# EasyEDA Pro project uven2-mk3-cc-driver-single.eprj, schematic uven2-mk3-cc-driver
Board Name: uven2-mk3-cc-driver; Create Date: 2025-05-26; Page Name: uven2-mk3-cc-driver; Project Name: uven2-mk3-cc-driver-single; Schematic Name: uven2-mk3-cc-driver; Update Date: 2025-05-27; File: uven2-mk3-cc-driver; Id: /; Sheet: /
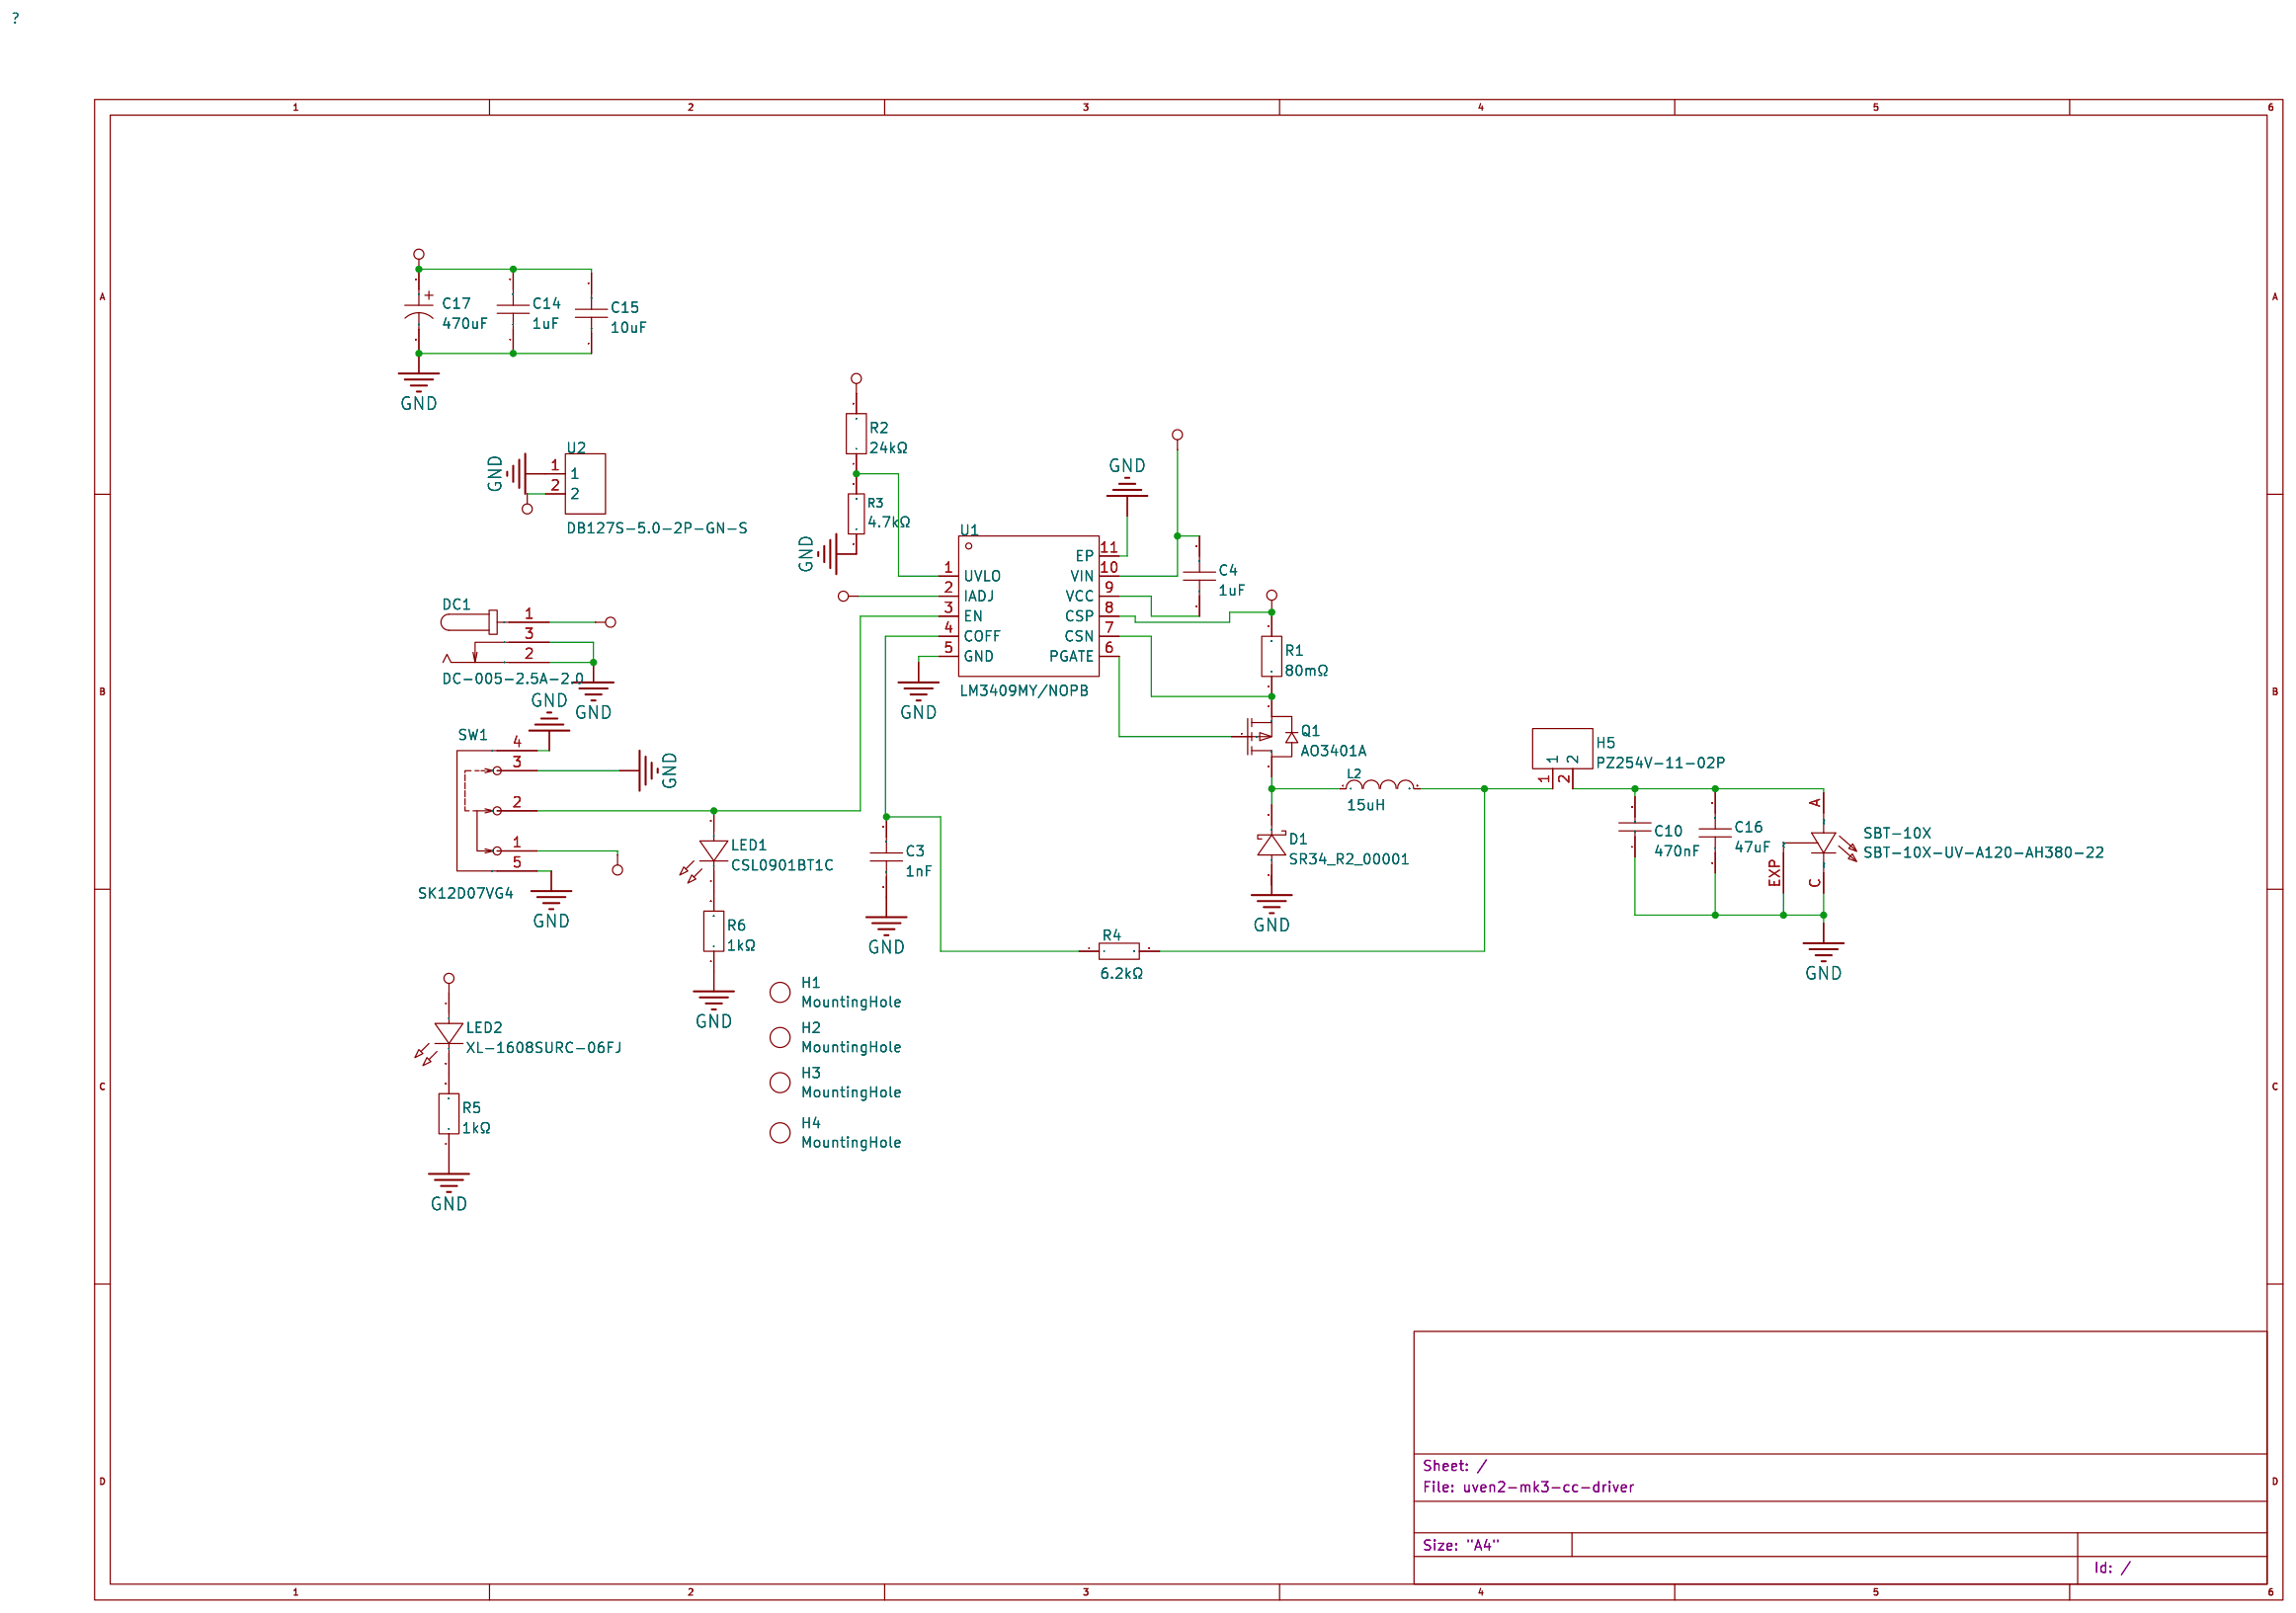
[diagram p0: schematic sheet]

## Parts
C3  1nF  [C0402]
C4  1uF  [C0603]
C10  470nF  [C0603]
C14  1uF  [C0603]
C15  10uF  [C0805]
C16  47uF  [C0805]
C17  470uF  [CAP-SMD_BD8.0-L8.3-W8.3-LS9.1-FD]
D1  SR34_R2_00001  [SMB_L4.3-W3.6-LS5.4-R-RD]
DC1  DC-005-2.5A-2.0  [CONN-TH_DC-005-2.5A-2.0]
H1  MountingHole  [MountingHole:MountingHole_2.2mm_M2]
H2  MountingHole  [MountingHole:MountingHole_2.2mm_M2]
H3  MountingHole  [MountingHole:MountingHole_2.2mm_M2]
H4  MountingHole  [MountingHole:MountingHole_2.2mm_M2]
H5  PZ254V-11-02P  [HDR-TH_2P-P2.54-V-M]
L2  15uH  [IND-SMD_L8.0-W8.0-HPC8040NF-150M]
LED1  CSL0901BT1C  [LED0603-RD_BLUE]
LED2  XL-1608SURC-06FJ  [LED0603-FD]
Q1  AO3401A  [SOT-23-3_L2.9-W1.3-P1.90-LS2.4-BR]
R1  80mΩ  [RES-SMD_L6.4-W3.2-1]
R2  24kΩ  [R0402]
R3  4.7kΩ  [R0402]
R4  6.2kΩ  [R0402]
R5  1kΩ  [R0402]
R6  1kΩ  [R0402]
SBT-10X  SBT-10X-UV-A120-AH380-22  [custom_lib:LED_SBT-10X-UV-A120-AH380-22]
SW1  SK12D07VG4  [SW-TH_SK12D07VG4]
U1  LM3409MY/NOPB  [HVSSOP-10_L3.0-W3.0-P0.50-LS4.9-BL-EP]
U2  DB127S-5.0-2P-GN-S  [CONN-TH_DB127S-5.0-2P-GN-S]

## Library data of the parts
C3 = TCC0402X7R102M500AT: LCSC Part Name: 1nF ±20% 50V; Supplier Part: C696907; Manufacturer: CCTC(三环); Supplier Footprint: 0402; JLCPCB Part Class: Extended Part; Datasheet: https://atta.szlcsc.com/upload/public/pdf/source/20200707/C696841_89A2C111301AB76AE7642008585E7A11.pdf; Supplier: LCSC; Tolerance: ±20%; Voltage Rating: 50V; Temperature Coefficient: X7R
C4 C14 = CL10A105KB8NNNC: LCSC Part Name: 1uF ±10% 50V; Supplier Part: C15849; Manufacturer: SAMSUNG(三星); Supplier Footprint: 0603; JLCPCB Part Class: Basic Part; Datasheet: https://atta.szlcsc.com/upload/public/pdf/source/20160218/1457707763339.pdf; Supplier: LCSC; Tolerance: ±10%
C10 = CL10B474KA8NNNC: LCSC Part Name: 470nF ±10% 25V; Supplier Part: C1623; Manufacturer: SAMSUNG(三星); Supplier Footprint: 0603; JLCPCB Part Class: Basic Part; Datasheet: https://atta.szlcsc.com/upload/public/pdf/source/20160218/1457707763339.pdf; Supplier: LCSC; Tolerance: ±10%
C15 = GRM21BR61H106KE43L: LCSC Part Name: 10uF ±10% 50V; Supplier Part: C440198; Manufacturer: muRata(村田); Supplier Footprint: 0805; JLCPCB Part Class: Basic Part; Datasheet: https://atta.szlcsc.com/upload/public/pdf/source/20230811/95AAE0C9AF55EDC31B7A4D8B733F534E.pdf; Supplier: LCSC; Tolerance: ±10%
C16 = CGA0805X5R476M100MT: LCSC Part Name: 47uF ±20% 10V; Supplier Part: C6119904; Manufacturer: HRE(芯声); Supplier Footprint: 0805; JLCPCB Part Class: Extended Part; Supplier: LCSC; Tolerance: ±20%; Voltage Rating: 10V; Temperature Coefficient: X5R
C17 = GVT1E477M0810CNVC: LCSC Part Name: 470uF ±20% 25V; Supplier Part: C2983319; Manufacturer: HRK(鸿瑞凯电子); Supplier Footprint: SMD,D8xL10.5mm; JLCPCB Part Class: Extended Part; Datasheet: https://atta.szlcsc.com/upload/public/pdf/source/20221207/309A0E7A4E93E57591E8CB40CFAF96D3.pdf; Supplier: LCSC; Tolerance: ±20%; Voltage Rating: 25V; Diameter: 8mm; Height - Seated (Max): 10.5mm; Lifetime: 2000hrs@105℃; Operating Temperature: -55℃~+105℃
D1 = SR34_R2_00001: LCSC Part Name: 电压:40V 电流:3A; Supplier Part: C391712; Manufacturer: PANJIT(强茂); Supplier Footprint: SMB; JLCPCB Part Class: Extended Part; Datasheet: https://atta.szlcsc.com/upload/public/pdf/source/20200904/C391712_B432CC20561232D88205F89496125F85.pdf; Supplier: LCSC; Diode Configuration: Independent Type; Forward Voltage (Vf@If): 500mV@5A; Reverse Voltage (Vr): 40V; Rectified Current: 3A; Reverse Leakage Current (Ir): 200uA@40V
DC1 = DC-005-2.5A-2.0: LCSC Part Name: DC电源插座 内径:2mm 外径:6.2mm; Supplier Part: C319099; Manufacturer: XKB Connection(中国星坤); Supplier Footprint: 插件; JLCPCB Part Class: Extended Part; Datasheet: https://atta.szlcsc.com/upload/public/pdf/source/20230410/3C172F25A51FCA230ABE6D36425CBB3B.pdf; Supplier: LCSC; Connector Type: DC Power Receptacle; Mounting Style: Panel Mounting; Inside Contact Diameter: 2mm; Outside Contact Diameter: 6.2mm; Operating Temperature Range: -20℃~+70℃
H1-H4 = Mechanical_MountingHole: Users: REF**
H5 = PZ254V-11-02P: LCSC Part Name: 1x2P 间距:2.54mm 方针 直插; Supplier Part: C492401; Manufacturer: XFCN(兴飞); Supplier Footprint: 插件,P=2.54mm; JLCPCB Part Class: Extended Part; Datasheet: https://atta.szlcsc.com/upload/public/pdf/source/20200309/C492401_A812433581A9B211A7FFA413ADDFF0E5.pdf; Supplier: LCSC; Pin Structure: 1x2P; Pitch: 2.54mm; Circluar Pins/Square Pins: Policy; Mounting Type: Straight; Number of Rows: Single Row; Number of Pins: 2P; Length of Mating Pin: 6mm; Insulation Height: 2.5mm; Length of End Connection Pin: 3mm; Contact Material: Brass; Operating Temperature: -40℃~+105℃; Color: Black
L2 = HPC8040NF-150M: LCSC Part Name: 15uH ±20%; Supplier Part: C357081; Manufacturer: TAI-TECH(台庆); Supplier Footprint: SMD; JLCPCB Part Class: Extended Part; Datasheet: https://atta.szlcsc.com/upload/public/pdf/source/20200917/C357081_4A67B6405062159579418D5590B6376F.pdf; Supplier: LCSC; Tolerance: ±20%
LED1 = CSL0901BT1C: Supplier Part: C5629925; Manufacturer: ROHM(罗姆); Supplier Footprint: 0603; JLCPCB Part Class: Extended Part; Datasheet: https://atta.szlcsc.com/upload/public/pdf/source/20241031/DCE1FE83178A3CA0DA293661A5CE6E8E.pdf; Supplier: LCSC; Illumination Color: Blue; Voltage - Forward(Vf): 2.9V; Forward Current: 5mA; Wavelength - Dominant: 470nm; Luminous Intensity: 56mcd
LED2 = XL-1608SURC-06FJ: Supplier Part: C7371900; Manufacturer: XINGLIGHT(成兴光); Supplier Footprint: 0603; JLCPCB Part Class: Extended Part; Datasheet: https://atta.szlcsc.com/upload/public/pdf/source/20250327/BDBF012AD0E810E52F0C9EC7A1AF3819.pdf; Supplier: LCSC; Illumination Color: Red; Voltage - Forward(Vf): 1.8V~2.3V; Forward Current: 20mA; Wavelength - Dominant: 618nm~630nm; Lens Color: Colorless Transparent Lens; Luminous Intensity: 600mcd; Viewing Angle: 120°; Mounting Sytle: Positive Stick
Q1 = AO3401A: LCSC Part Name: 耐压:30V 电流:4.2A; Supplier Part: C5122001; Manufacturer: TECH PUBLIC(台舟); Supplier Footprint: SOT-23; JLCPCB Part Class: Extended Part; Datasheet: https://atta.szlcsc.com/upload/public/pdf/source/20220811/208673706F46EF46E2E13D7F68870739.pdf; Supplier: LCSC; Drain to Source Voltage: 30V; Current - Continuous Drain(Id): 4.2A; RDS(on): 55mΩ@10V,4.2A; Pd - Power Dissipation: 1.2W; Gate Charge(Qg): 8.5nC; Input Capacitance(Ciss@Vds): 880pF@15V; Reverse Transfer Capacitance (Crss@Vds): 65pF@15V; Operating Temperature: -55℃~+150℃
R1 = RLP25FEGR080: LCSC Part Name: 80mΩ ±1% 3W 合金电阻; Supplier Part: C459690; Manufacturer: 大毅科技; Supplier Footprint: 2512; JLCPCB Part Class: Extended Part; Datasheet: https://atta.szlcsc.com/upload/public/pdf/source/20191209/C467441_D59F70B0A5C6980F35DB1CB3CCA97CC4.pdf; Supplier: LCSC; Tolerance: ±1%; Temperature Coefficient: ±50ppm/℃
R2 = FRC0402F2402TS: LCSC Part Name: 24kΩ ±1% 62.5mW 厚膜电阻; Supplier Part: C2933082; Manufacturer: FOJAN(富捷); Supplier Footprint: 0402; JLCPCB Part Class: Extended Part; Datasheet: https://atta.szlcsc.com/upload/public/pdf/source/20211221/925EC7D7225764EE0046F22065062C87.pdf; Supplier: LCSC; Type: Thick Film Resistors; Tolerance: ±1%; Temperature Coefficient: ±100ppm/℃; Operating Temperature: -55℃~+155℃
R3 = 0402WGJ0472TCE: LCSC Part Name: 4.7kΩ ±5% 62.5mW 厚膜电阻; Supplier Part: C25940; Manufacturer: UNI-ROYAL(厚声); Supplier Footprint: 0402; JLCPCB Part Class: Extended Part; Datasheet: https://atta.szlcsc.com/upload/public/pdf/source/20200306/C422600_1E6D84923E4A46A82E41ADD87F860B5C.pdf; Supplier: LCSC; Type: Thick Film Resistors; Tolerance: ±5%; Temperature Coefficient: ±100ppm/℃; Operating Temperature Range: -55℃~+155℃
R4 = RC0402FR-076K2L: LCSC Part Name: 厚膜电阻 6.2kΩ ±1% 62.5mW; Supplier Part: C137946; Manufacturer: YAGEO(国巨); Supplier Footprint: 0402; JLCPCB Part Class: Extended Part; Datasheet: https://atta.szlcsc.com/upload/public/pdf/source/20181009/C309620_DA5935B6E1D48212CB7A533FE518B3C2.pdf; Supplier: LCSC; Type: Thick Film Resistors; Tolerance: ±1%; Temperature Coefficient: ±100ppm/℃; Operating Temperature Range: -55℃~+155℃
R5 R6 = AC0402FR-7W1KL: LCSC Part Name: 厚膜电阻 1kΩ ±1% 125mW; Supplier Part: C5455561; Manufacturer: YAGEO(国巨); Supplier Footprint: 0402; JLCPCB Part Class: Extended Part; Datasheet: https://atta.szlcsc.com/upload/public/pdf/source/20220104/CEFE4492A80C856C96F5347FFD9BB3EB.pdf; Supplier: LCSC; Type: Thick Film Resistors; Tolerance: ±1%; Power(Watts): 0.125W; Temperature Coefficient: ±100ppm/℃; Operating Temperature: -55℃~+155℃
SBT-10X = SBT-10X-UV-A120-AH380-22_SBT-10X-UV-A120-AH380-22: \n                        \n                            Ultraviolet (UV) Emitter 385nm, 1.3 W, 3.1V 1.0 A, 120°, 3.5mm x 3.5mm\n                        \n; availability: In Stock; check_prices: https://www.snapeda.com/parts/SBT-10X-UV-A120-AH380-22/Luminus+Devices/view-part/?ref=eda; manufacturer: Luminus Devices; maximum_package_height: 1.87mm; mf: Luminus Devices; partrev: 01; Package1: None; price: None; standard: Manufacturer Recommendations; snapeda_link: https://www.snapeda.com/parts/SBT-10X-UV-A120-AH380-22/Luminus+Devices/view-part/?ref=snap; MF: Luminus Devices; MAXIMUM_PACKAGE_HEIGHT: 1.87mm; Price: None; Check_prices: https://www.snapeda.com/parts/SBT-10X-UV-A120-AH380-22/Luminus+Devices/view-part/?ref=eda; STANDARD: Manufacturer Recommendations; PARTREV: 01; SnapEDA_Link: https://www.snapeda.com/parts/SBT-10X-UV-A120-AH380-22/Luminus+Devices/view-part/?ref=snap; Availability: In Stock; MANUFACTURER: Luminus Devices
SW1 = SK12D07VG4: LCSC Part Name: 3脚2档位 卧插 滑动开关; Supplier Part: C393937; Manufacturer: SHOU HAN(首韩); Supplier Footprint: 插件; JLCPCB Part Class: Extended Part; Datasheet: https://atta.szlcsc.com/upload/public/pdf/source/20190521/C393937_939FE26E571CC67D2D532E953108A1B0.pdf; Supplier: LCSC; Circuit: SPDT; Actuator Style: Rectangular columnar; Pin Style: PCPin; Switch Height: 8.8mm; Current Rating (DC): 500mA; Voltage Rating (DC): 50V; Mechanical Life: 5千次
U1 = LM3409MY/NOPB: Supplier Part: C527401; Manufacturer: TI(德州仪器); Supplier Footprint: HVSSOP-10-EP-0.5mm; JLCPCB Part Class: Extended Part; Datasheet: https://www.ti.com/cn/lit/gpn/lm3409; Supplier: LCSC; Number of Channels: 1; Dimming: PWM；Analog; Topology: Step-down; Operating temperature: -40℃~+125℃
U2 = DB127S-5.0-2P-GN-S: LCSC Part Name: 1x2P 5mm 直插 排数:1 每排P数:2; Supplier Part: C36493722; Manufacturer: DORABO(地博电气); Supplier Footprint: 插件,P=5mm; Datasheet: https://atta.szlcsc.com/upload/public/pdf/source/20240730/F55BCE3D282E7F380BA9986CDA4F4CC9.pdf; Supplier: LCSC; Number of Positions or Pins: 1x2P; Pitch: 5mm; Color: Green; Mounting Type: Straight; Number of Pins: 2P; Number of Rows: 1; Number of PINs Per Row: 2; Screw Specification: M3; Current Rating: 12A; Voltage Rating (Max): 300V; Wire Gauge - AWG: 14~26; Wire Gauge - mm2: 1.5; Operating Temperature: -40℃~+105℃

## Nets
GND: C3.1 C10.1 C14.1 C15.1 C16.1 C17.2 D1.1(A) DC1.2 DC1.3 R3.1 R5.1 R6.1 SBT-10X.C SBT-10X.EXP SW1.3 SW1.4 SW1.5 U1.5(GND) U1.11(EP) U2.1
LED-DRIVER-RESCUE_VCC-LED-DRIVER-RESCUE: C4.2 C14.2 C15.2 C17.1 DC1.1 LED2.1(A) R1.2 R2.2 SW1.1 U1.2(IADJ) U1.8(CSP) U1.10(VIN) U2.2
$1N7: C4.1 U1.9(VCC)
$1N10: R2.1 R3.2 U1.1(UVLO)
$1N16: Q1.2(S) R1.1 U1.7(CSN)
$1N1538: LED1.2(A) SW1.2 U1.3(EN)
$1N2515: C3.2 R4.1 U1.4(COFF)
$1N3276: Q1.1(G) U1.6(PGATE)
$1N3283: D1.2(K) L2.1 Q1.3(D)
$1N3668: LED2.2(K) R5.2
$1N3737: LED1.1(K) R6.2
$1N4935: C10.2 C16.2 H5.2 SBT-10X.A
$1N4941: H5.1 L2.2 R4.2
